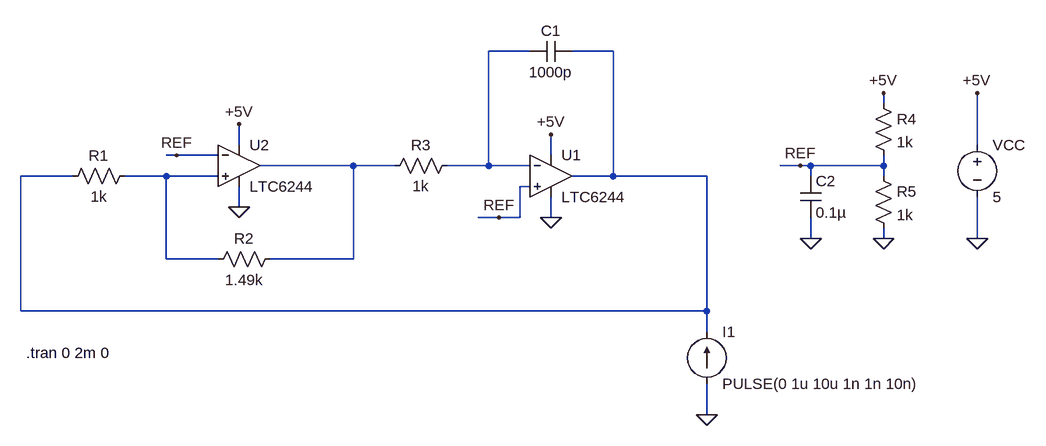
[diagram p0: schematic Triangle_Generator.asc]
Triangle_Generator.asc, the LTspice schematic file:
Version 4
SHEET 1 3384 680
WIRE 1168 -752 1104 -752
WIRE 1296 -752 1232 -752
WIRE 1712 -672 1712 -688
WIRE 720 -608 720 -640
WIRE 1856 -608 1856 -688
WIRE 624 -592 608 -592
WIRE 688 -592 624 -592
WIRE 1200 -592 1200 -624
WIRE 896 -576 752 -576
WIRE 960 -576 896 -576
WIRE 1104 -576 1104 -752
WIRE 1104 -576 1040 -576
WIRE 1168 -576 1104 -576
WIRE 1584 -576 1552 -576
WIRE 1600 -576 1584 -576
WIRE 1712 -576 1712 -592
WIRE 1712 -576 1600 -576
WIRE 464 -560 384 -560
WIRE 608 -560 544 -560
WIRE 688 -560 608 -560
WIRE 1296 -560 1296 -752
WIRE 1296 -560 1232 -560
WIRE 1440 -560 1296 -560
WIRE 1600 -560 1600 -576
WIRE 1712 -560 1712 -576
WIRE 1168 -544 1152 -544
WIRE 720 -512 720 -544
WIRE 1120 -496 1088 -496
WIRE 1152 -496 1152 -544
WIRE 1152 -496 1120 -496
WIRE 1200 -496 1200 -528
WIRE 1600 -464 1600 -496
WIRE 1712 -464 1712 -480
WIRE 1856 -464 1856 -528
WIRE 608 -432 608 -560
WIRE 688 -432 608 -432
WIRE 896 -432 896 -576
WIRE 896 -432 768 -432
WIRE 384 -352 384 -560
WIRE 1440 -352 1440 -560
WIRE 1440 -352 384 -352
WIRE 1440 -320 1440 -352
WIRE 1440 -192 1440 -240
FLAG 1856 -688 +5V
FLAG 1856 -464 0
FLAG 720 -640 +5V
FLAG 720 -512 0
FLAG 624 -592 REF
FLAG 1200 -624 +5V
FLAG 1200 -496 0
FLAG 1120 -496 REF
FLAG 1712 -688 +5V
FLAG 1712 -464 0
FLAG 1584 -576 REF
FLAG 1440 -192 0
FLAG 1600 -464 0
SYMBOL voltage 1856 -624 R0
WINDOW 123 0 0 Left 0
WINDOW 39 0 0 Left 0
SYMATTR InstName VCC
SYMATTR Value 5
SYMBOL res 560 -576 R90
WINDOW 0 0 56 VBottom 2
WINDOW 3 32 56 VTop 2
SYMATTR InstName R1
SYMATTR Value 1k
SYMBOL res 784 -448 R90
WINDOW 0 0 56 VBottom 2
WINDOW 3 32 56 VTop 2
SYMATTR InstName R2
SYMATTR Value 1.49k
SYMBOL res 1056 -592 R90
WINDOW 0 0 56 VBottom 2
WINDOW 3 32 56 VTop 2
SYMATTR InstName R3
SYMATTR Value 1k
SYMBOL cap 1232 -768 R90
WINDOW 0 0 32 VBottom 2
WINDOW 3 32 32 VTop 2
SYMATTR InstName C1
SYMATTR Value 1000p
SYMBOL res 1696 -688 R0
SYMATTR InstName R4
SYMATTR Value 1k
SYMBOL res 1696 -576 R0
SYMATTR InstName R5
SYMATTR Value 1k
SYMBOL current 1440 -240 M180
WINDOW 0 24 80 Left 2
WINDOW 3 24 0 Left 2
WINDOW 123 0 0 Left 0
WINDOW 39 0 0 Left 0
SYMATTR InstName I1
SYMATTR Value PULSE(0 1u 10u 1n 1n 10n)
SYMBOL cap 1584 -560 R0
SYMATTR InstName C2
SYMATTR Value 0.1µ
SYMBOL OpAmps\\LTC6244 1200 -560 R0
SYMATTR InstName U1
SYMBOL OpAmps\\LTC6244 720 -576 R0
SYMATTR InstName U2
TEXT 392 -288 Left 2 !.tran 0 2m 0

The netlist it stands for:
* Triangle_Generator.asc
VCC +5V 0 5
R1 N004 N002 1k
R2 N003 N004 1.49k
R3 N001 N003 1k
C1 N002 N001 1000p
R4 +5V REF 1k
R5 REF 0 1k
I1 0 N002 PULSE(0 1u 10u 1n 1n 10n)
C2 REF 0 0.1µ
XU1 REF N001 +5V 0 N002 LTC6244  ; pins In+ In- V+ V- OUT
XU2 N004 REF +5V 0 N003 LTC6244  ; pins In+ In- V+ V- OUT
.tran 0 2m 0
.backanno
.end